# Altium schematic sheet energy.SchDoc
size A4
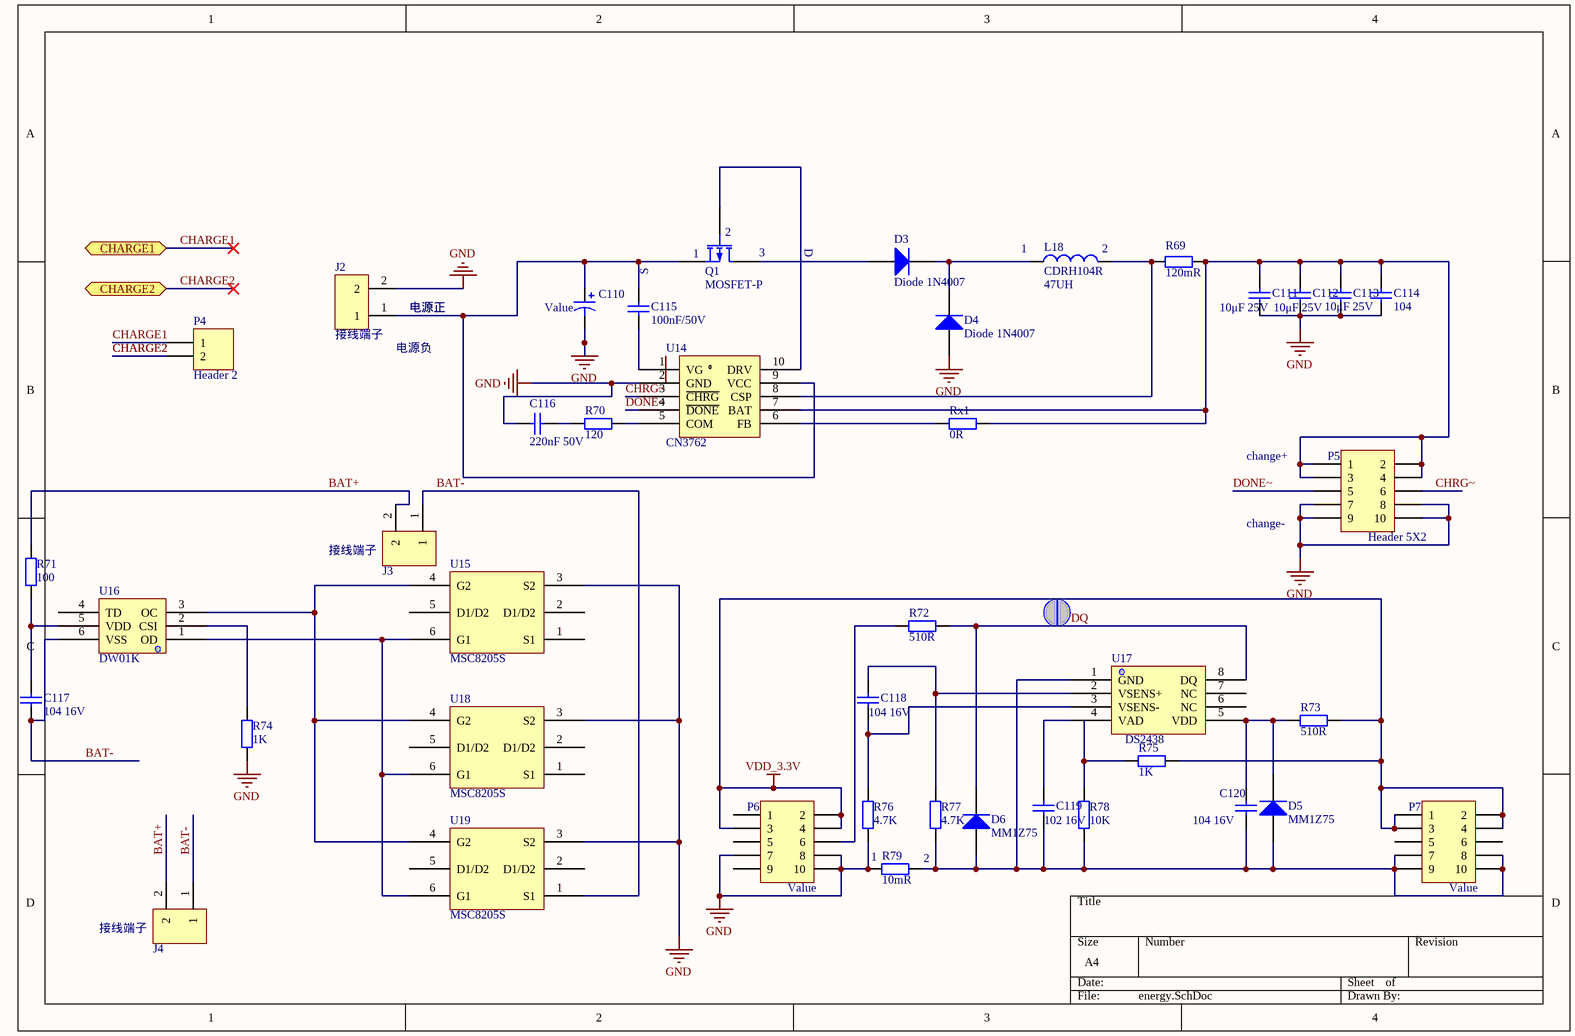
[diagram p0: energy.SchDoc]

## Parts
C110  Value  [RB5.0-13]
C111  10μF 25V  [0805C]
C112  10μF 25V  [0805C]
C113  10μF 25V  [0805C]
C114  104  [0805C]
C115  100nF/50V  [0805C]
C116  220nF 50V  [0805C]
C117  104 16V  [0805C]
C118  104 16V  [0805C]
C119  102 16V  [0805C]
C120  104 16V  [0805C]
D3  Diode 1N4007  [DO-41]
D4  Diode 1N4007  [DO-41]
D5  MM1Z75  [DO-41]
D6  MM1Z75  [DO-41]
J2  接线端子  [接线端子KF301-2P]
J3  接线端子  [接线端子KF301-2P]
J4  接线端子  [接线端子KF301-2P]
L18  CDRH104R  value 47UH  [0402-A]
P4  Header 2  [HDR1X2]
P5  Header 5X2  [HDR2X5]
P6  Value  [HDR2X5]
P7  Value  [HDR2X5]
Q1  MOSFET-P  [E3]
R69  120mR  [0805R]
R70  120  [0805R]
R71  100  [0805R]
R72  510R  [0805R]
R73  510R  [0805R]
R74  1K  [0805R]
R75  1K  [0805R]
R76  4.7K  [0805R]
R77  4.7K  [0805R]
R78  10K  [0805R]
R79  10mR  [0805R]
Rx1  0R  [0805R]
U14  CN3762  [SOP100P600X175-10N]
U15  MSC8205S  [SOT95P290X124-6N]
U16  DW01K  [SOT95P280X125-6N]
U17  DS2438  [SOP127P800X216-8N]
U18  MSC8205S  [SOT95P290X124-6N]
U19  MSC8205S  [SOT95P290X124-6N]

## Ports
CHARGE1 (bidir), CHARGE2 (bidir)

## Nets
GND: C110.2 C111.2 C112.2 C113.2 C114.2 C116.2 D4.1(A) J2.2 P5.7 P5.8 P5.9 P5.10 P6.7 P6.8 P6.10 R74.1 R76.2 R79.1 U14.2(GND) U15.3(S2) U18.3(S2) U19.3(S2)
VDD_3.3V: P6.2 P6.3 P6.4 P7.1 P7.2 P7.3 P7.4 R73.1 R75.1
BAT+: J3.2 J4.2 R71.2
BAT-: C117.1 J3.1 J4.1 U16.6(VSS) U19.1(S1)
CHARGE1: P4.1 ; port CHARGE1
CHARGE2: P4.2 ; port CHARGE2
CHRG~: P5.6 U14.3(~{CHRG})
DONE~: P5.5 U14.4(~{DONE})
DQ: D6.2(K) R72.1 U17.8(DQ)
NetC110_1: C110.1 C115.2 J2.1 Q1.3(S) U14.9(VCC)
NetC111_1: C111.1 C112.1 C113.1 C114.1 P5.1 P5.2 P5.3 P5.4 R69.1 Rx1.1 U14.7(BAT)
NetC115_1: C115.1 U14.1(VG)
NetC116_1: C116.1 R70.2
NetC117_2: C117.2 R71.1 U16.5(VDD)
NetC118_1: C118.1 R77.1 U17.2(VSENS+)
NetC118_2: C118.2 R76.1 U17.3(VSENS-)
NetC119_1: C119.1 U17.4(VAD)
NetC119_2: C119.2 C120.2 D5.1(A) D6.1(A) P7.7 P7.8 P7.9 P7.10 R77.2 R78.2 R79.2 U17.1(GND)
NetC120_1: C120.1 D5.2(K) R73.2 U17.5(VDD)
NetD3_1: D3.1(A) Q1.1(D)
NetD3_2: D3.2(K) D4.2(K) L18.1
NetL18_2: L18.2 R69.2 U14.8(CSP)
NetP6_6: P6.6 R72.2
NetQ1_2: Q1.2(G) U14.10(DRV)
NetR70_1: R70.1 U14.5(COM)
NetR74_2: R74.2 U16.2(CSI)
NetR75_2: R75.2 R78.1
NetRx1_2: Rx1.2 U14.6(FB)
NetU15_4: U15.4(G2) U16.3(OC) U18.4(G2) U19.4(G2)
NetU15_6: U15.6(G1) U16.1(OD) U18.6(G1) U19.6(G1)

Not connected (* = marked no-connect by the designer): P6 1 5 9; P7 5 6; U15 1(S1) 2(D1/D2) 5(D1/D2); U16 4(TD); U17 6(NC) 7(NC); U18 1(S1) 2(D1/D2) 5(D1/D2); U19 2(D1/D2) 5(D1/D2)

## Notes on the sheet
- (near Q1) 2
- D
- (near J2) 电源正
- (near C115) S
- (near Q1) 1
- (near Q1) 3
- (near L18) 1
- (near L18) 2
- (near J2) 电源负
- (near P5) change+
- (near P5) change-
- (near R79) 1
- 2

## Library data of the parts
C110 = Cap_Pol
C111-C120 = Cap
D3-D6 = Diode 1N4007: 1 Amp General Purpose Rectifier; Published: 8-Jun-2000; LatestRevisionDate: 17-Jul-2002; LatestRevisionNote: Re-released for DXP Platform.; DatasheetVersion: 1998; PackageVersion: Aug-1999; PackageReference: DO-41; Publisher: Altium Limited; PackageDescription: Diode, Axial; Body 5.2 x 2.7 mm (LxDia. max), Lead Dia. 0.86 mm (max); Code_JEDEC: DO-204-AL; ComponentLink1Description: Manufacturer Link; ComponentLink1URL: http://www.fairchildsemi.com/; ComponentLink2Description: Datasheet; ComponentLink2URL: http://www.fairchildsemi.com/ds/1N%2F1N4001.pdf
J2-J4 = 接线端子: 原理图绘制者: 刘永钦; 原理图何处使用过: 2014年飞思卡尔底板; 原理图审核人1: 徐鹏飞; 封装接线端子KF301-2P绘制者: 10级718学长; 封装接线端子KF301-2P何处使用过: 2015年航行器遥控器; 原理图审核人2: 朱觉文; 原理图提供者: 刘永钦; 封装接线端子KF301-2P提供者: 刘永钦; 封装接线端子KF301-2P审核人1: 徐鹏飞; 封装接线端子KF301-2P审核人2: 朱觉文
L18 = Inductor: Code_IEC: 1005; Published: 8-Jun-2000; LatestRevisionDate: 29-May-2009; LatestRevisionNote: IPC-7351 Footprint Added.; PackageReference: 0402-A; Publisher: Altium Limited; PackageDescription: Chip Inductor; Code_JEITA: 0402
P4 = Header 2: Header, 2-Pin; LatestRevisionDate: 17-Jul-2002; LatestRevisionNote: Re-released for DXP Platform.; Publisher: Altium Limited
P5-P7 = Header 5X2: Header, 5-Pin, Dual row; LatestRevisionDate: 17-Jul-2002; LatestRevisionNote: Re-released for DXP Platform.; Publisher: Altium Limited
Q1 = MOSFET-P: P-Channel MOSFET; Published: 8-Jun-2000; LatestRevisionDate: 17-Jul-2002; LatestRevisionNote: Re-released for DXP Platform.; PackageVersion: 1995/1996; PackageReference: E3; Publisher: Altium Limited; PackageDescription: TO, Flat Index; 3 In-Line, Axial Leads; Body Dia. 4.6mm; Lead Dia. 0.5 mm (max)
R69-R79 Rx1 = Res